# Altium schematic sheet main.SchDoc
size A1
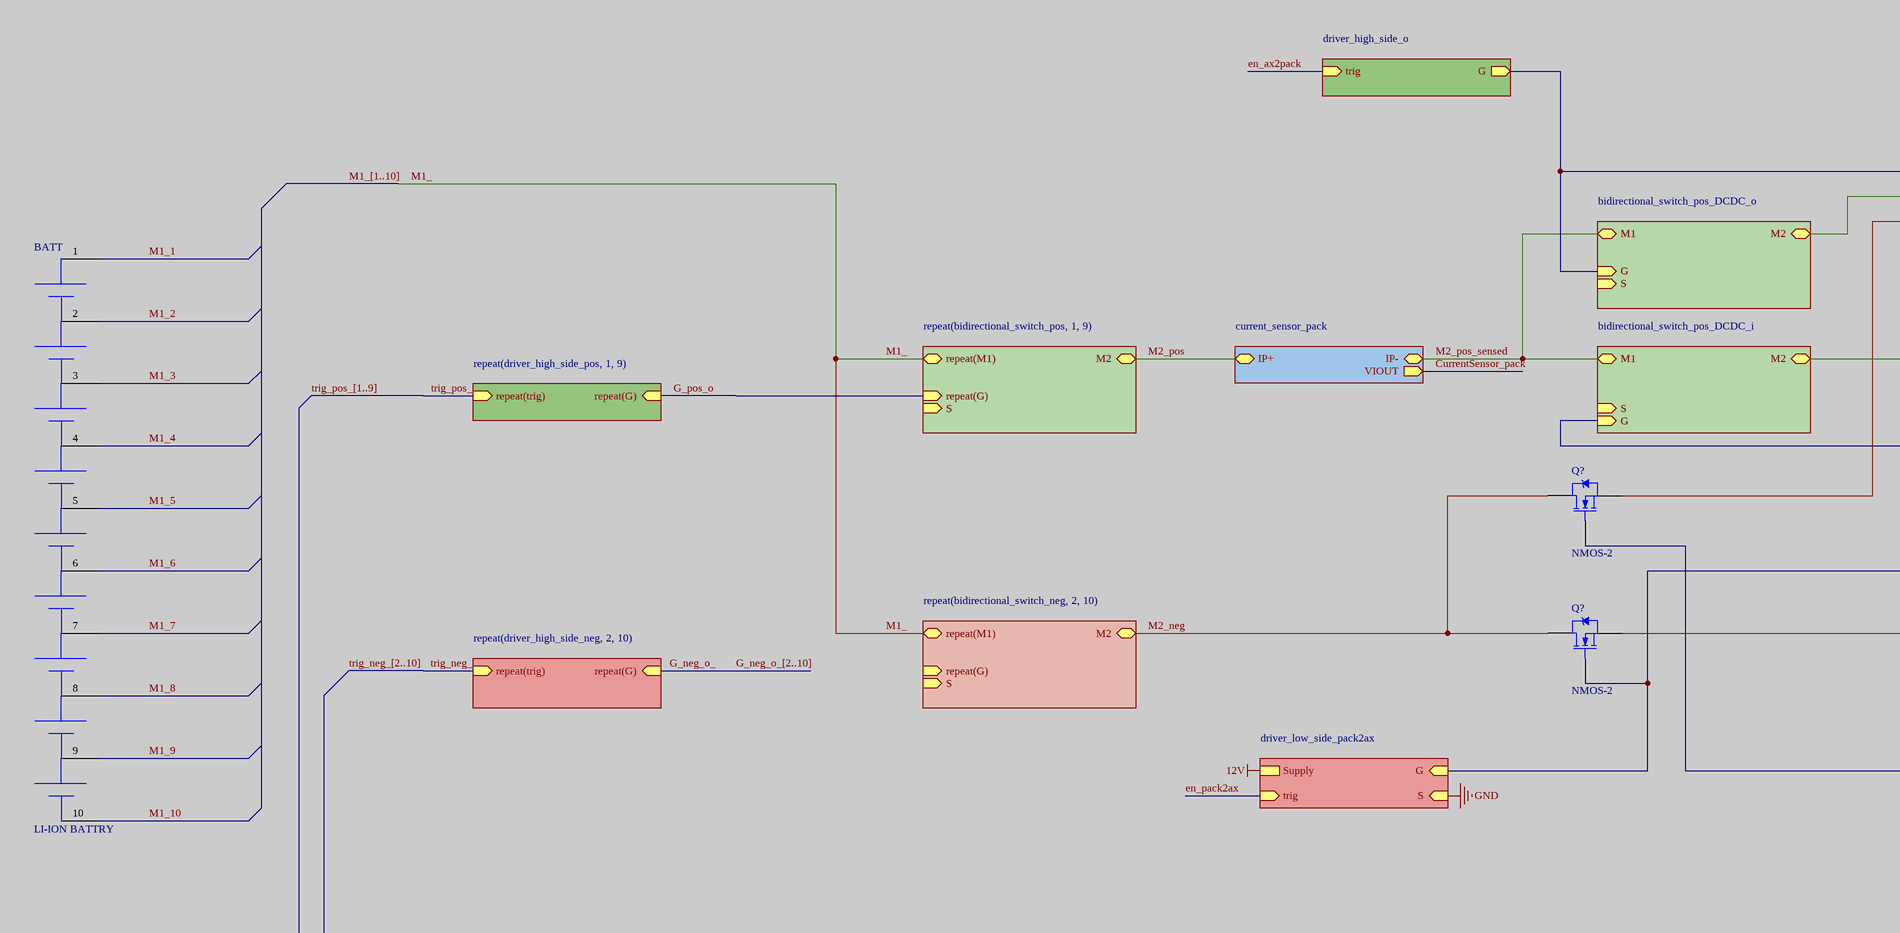
[diagram p0: main.SchDoc, left]
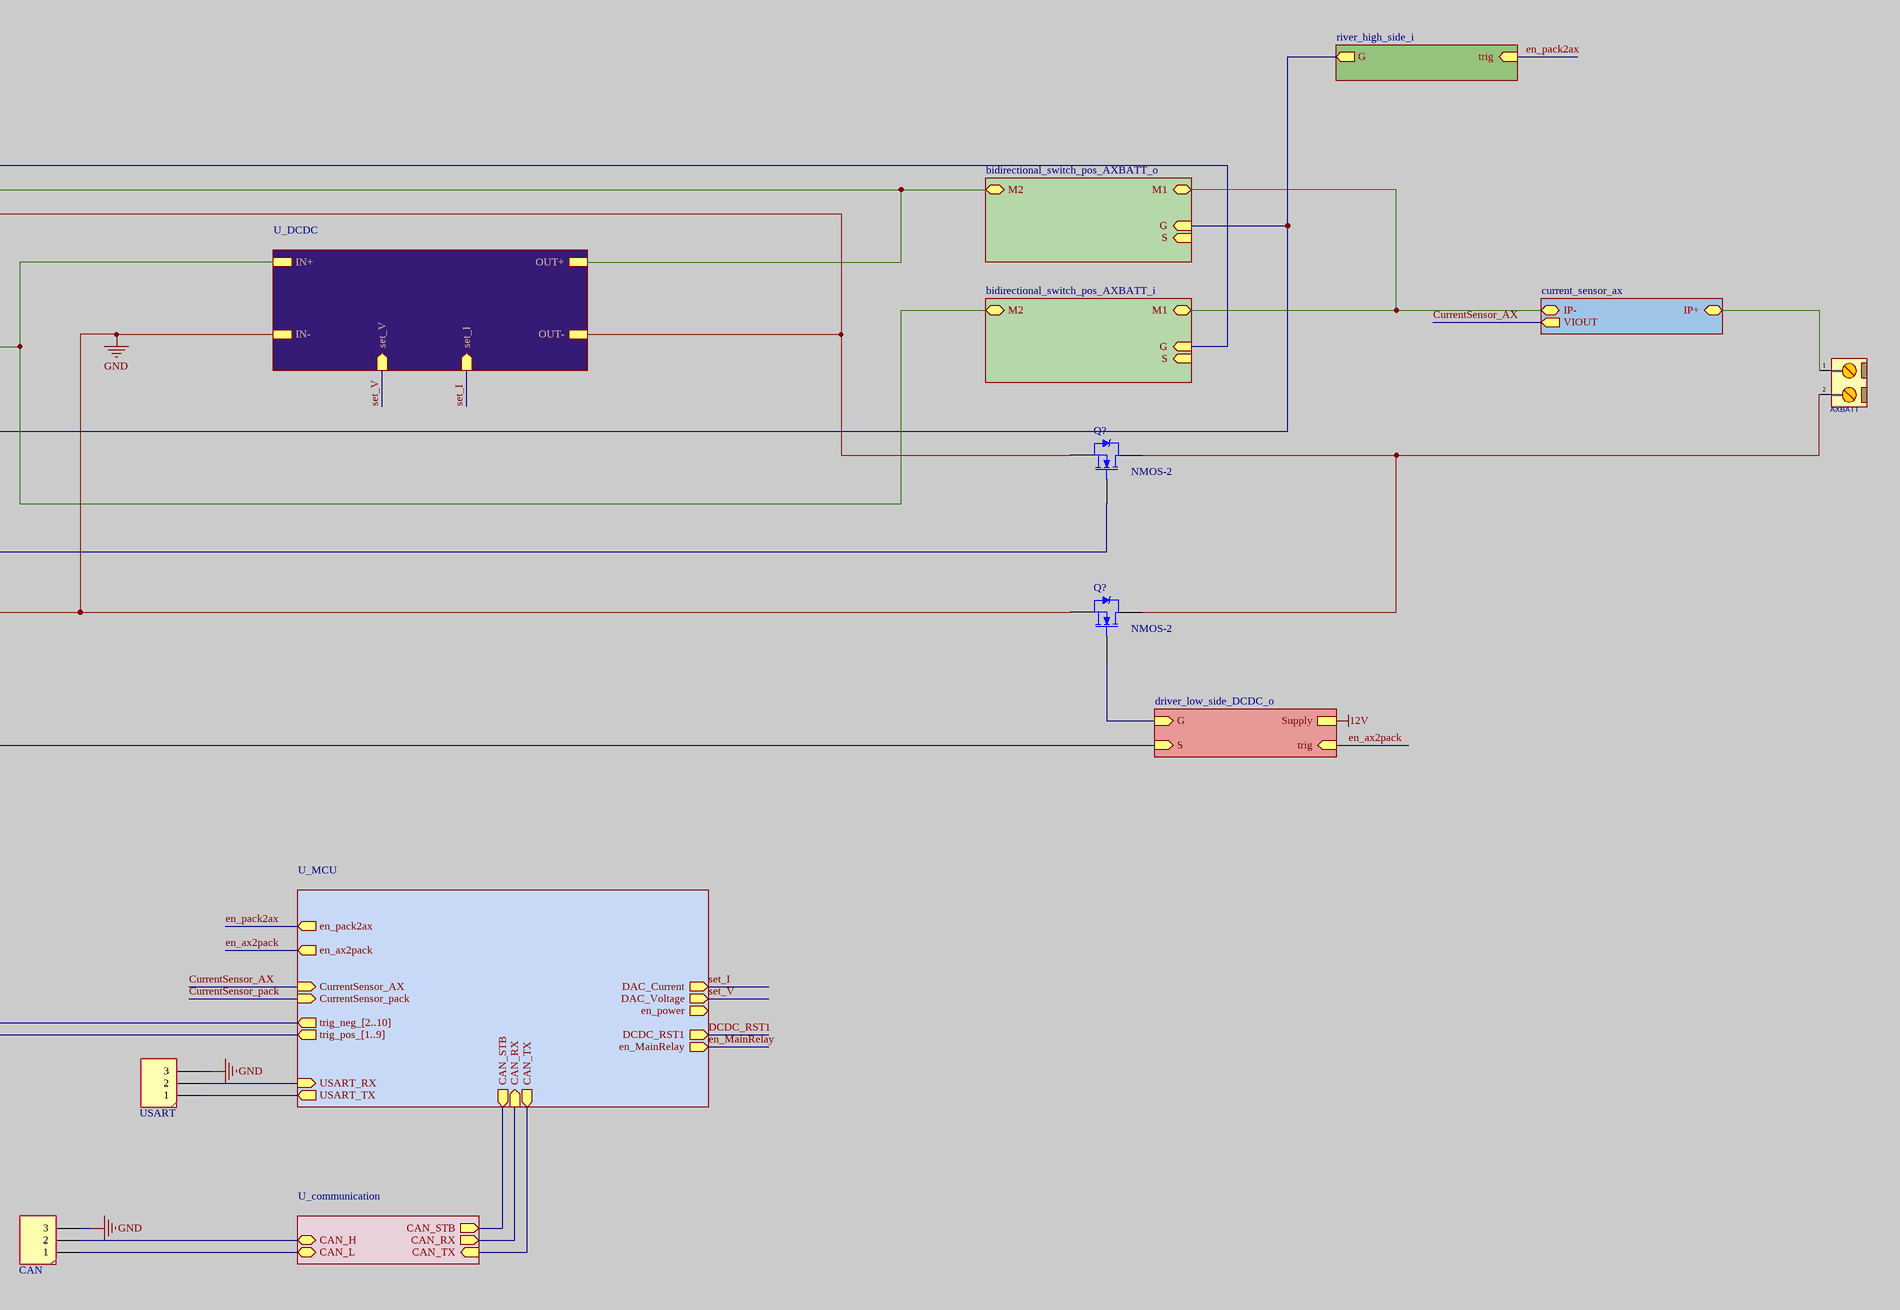
[diagram p1: main.SchDoc, right]

## Parts
(Parts that share a designator on the sheet are numbered #1, #2 ... from top to bottom, then left to right.)
AXBATT  CONN_TB8  (value not drawn)
BATT  LI-ION BATTRY  [HEADER1*10]
CAN  DCDC_CTRL  [HEADER1*3]  (value not drawn)
Q?#1  NMOS-2  [dpak]
Q?#2  NMOS-2  [dpak]
Q?#3  NMOS-2  [dpak]
Q?#4  NMOS-2  [dpak]
USART  DCDC_CTRL  [HEADER1*3]  (value not drawn)

## Sub-sheets
bidirectional_switch_pos_AXBATT_i = bidirectional_switch.SchDoc: M1 (bidir), M2 (bidir), G (in), S (in)
bidirectional_switch_pos_AXBATT_o = bidirectional_switch.SchDoc: M1 (bidir), M2 (bidir), G (in), S (in)
bidirectional_switch_pos_DCDC_i = bidirectional_switch.SchDoc: M1 (bidir), M2 (bidir), G (in), S (in)
bidirectional_switch_pos_DCDC_o = bidirectional_switch.SchDoc: M1 (bidir), M2 (bidir), G (in), S (in)
current_sensor_ax = current_sensor.SchDoc: IP+ (bidir), IP- (bidir), VIOUT (out)
current_sensor_pack = current_sensor.SchDoc: IP+ (bidir), IP- (bidir), VIOUT (out)
driver_high_side_o = driver_high_side.SchDoc: trig (in), G (out)
driver_low_side_DCDC_o = driver_low_side.SchDoc: Supply, trig (in), G (in), S (in)
driver_low_side_pack2ax = driver_low_side.SchDoc: Supply, trig (in), G (in), S (in)
repeat(bidirectional_switch_neg, 2, 10) = bidirectional_switch.SchDoc: repeat(M1) (bidir), M2 (bidir), repeat(G) (in), S (in)
repeat(bidirectional_switch_pos, 1, 9) = bidirectional_switch.SchDoc: repeat(M1) (bidir), M2 (bidir), repeat(G) (in), S (in)
repeat(driver_high_side_neg, 2, 10) = driver_high_side.SchDoc: repeat(trig) (in), repeat(G) (in)
repeat(driver_high_side_pos, 1, 9) = driver_high_side.SchDoc: repeat(trig) (in), repeat(G) (in)
river_high_side_i = driver_high_side.SchDoc: trig (in), G (out)
U_communication = communication.SchDoc: CAN_TX (in), CAN_RX (out), CAN_H (bidir), CAN_L (bidir), CAN_STB (out)
U_DCDC = DCDC.SchDoc: IN+, IN-, OUT+, OUT-, set_V (in), set_I (in)
U_MCU = MCU.SchDoc: CurrentSensor_AX (in), CurrentSensor_pack (in), DAC_Current (out), DAC_Voltage (out), en_power (out), USART_TX (out), USART_RX (in), DCDC_RST1 (out), en_MainRelay (out), CAN_TX (out), CAN_RX (in), CAN_STB (out), trig_pos_[1..9] (out), trig_neg_[2..10] (out), en_pack2ax (out), en_ax2pack (out)

## Nets
12V: sheet driver_low_side_pack2ax/Supply, sheet driver_low_side_DCDC_o/Supply
GND: CAN.3 Q?#3.3(S) Q?#4.3(S) USART.3 ; sheet driver_low_side_pack2ax/S, sheet U_DCDC/IN-
CurrentSensor_AX: sheet current_sensor_ax/VIOUT, sheet U_MCU/CurrentSensor_AX
CurrentSensor_pack: sheet current_sensor_pack/VIOUT, sheet U_MCU/CurrentSensor_pack
DCDC_RST1: sheet U_MCU/DCDC_RST1
en_ax2pack: sheet driver_low_side_DCDC_o/trig, sheet driver_high_side_o/trig, sheet U_MCU/en_ax2pack
en_MainRelay: sheet U_MCU/en_MainRelay
en_pack2ax: sheet driver_low_side_pack2ax/trig, sheet river_high_side_i/trig, sheet U_MCU/en_pack2ax
G_neg_o_: sheet repeat(driver_high_side_neg, 2, 10)/repeat(G)
G_pos_o: sheet repeat(driver_high_side_pos, 1, 9)/repeat(G)
M1_: sheet repeat(bidirectional_switch_neg, 2, 10)/repeat(M1), sheet repeat(bidirectional_switch_pos, 1, 9)/repeat(M1)
M1_1: BATT.1
M1_2: BATT.2
M1_3: BATT.3
M1_4: BATT.4
M1_5: BATT.5
M1_6: BATT.6
M1_7: BATT.7
M1_8: BATT.8
M1_9: BATT.9
M1_10: BATT.10
M2_neg: Q?#2.2(D) Q?#3.2(D) ; sheet repeat(bidirectional_switch_neg, 2, 10)/M2
M2_pos: sheet repeat(bidirectional_switch_pos, 1, 9)/M2, sheet current_sensor_pack/IP+
M2_pos_sensed: sheet bidirectional_switch_pos_DCDC_i/M1, sheet bidirectional_switch_pos_DCDC_o/M1, sheet current_sensor_pack/IP-
set_I: sheet U_MCU/DAC_Current, sheet U_DCDC/set_I
set_V: sheet U_MCU/DAC_Voltage, sheet U_DCDC/set_V
trig_neg_: sheet repeat(driver_high_side_neg, 2, 10)/repeat(trig)
trig_pos_: sheet repeat(driver_high_side_pos, 1, 9)/repeat(trig)
NetAXBATT_1: AXBATT.1 ; sheet current_sensor_ax/IP+
NetAXBATT_2: AXBATT.2 Q?#1.2(D) Q?#4.2(D)
NetCAN_1: CAN.1 ; sheet U_communication/CAN_L
NetCAN_2: CAN.2 ; sheet U_communication/CAN_H
NetQ?#1_1: Q?#1.1(G) Q?#3.1(G) ; sheet driver_low_side_pack2ax/G
NetQ?#1_3: Q?#1.3(S) Q?#2.3(S) ; sheet U_DCDC/OUT-
NetQ?#2_1: Q?#2.1(G) ; sheet driver_low_side_DCDC_o/S
NetQ?#4_1: Q?#4.1(G) ; sheet driver_low_side_DCDC_o/G
NetUSART_1: USART.1 ; sheet U_MCU/USART_TX
NetUSART_2: USART.2 ; sheet U_MCU/USART_RX
(unnamed): sheet bidirectional_switch_pos_DCDC_i/M2, sheet bidirectional_switch_pos_AXBATT_i/M2, sheet U_DCDC/IN+
(unnamed): sheet bidirectional_switch_pos_DCDC_i/G, sheet bidirectional_switch_pos_AXBATT_o/G, sheet river_high_side_i/G
(unnamed): sheet bidirectional_switch_pos_DCDC_o/M2, sheet bidirectional_switch_pos_AXBATT_o/M2, sheet U_DCDC/OUT+
(unnamed): sheet bidirectional_switch_pos_DCDC_o/G, sheet bidirectional_switch_pos_AXBATT_i/G, sheet driver_high_side_o/G
(unnamed): sheet bidirectional_switch_pos_AXBATT_i/M1, sheet bidirectional_switch_pos_AXBATT_o/M1, sheet current_sensor_ax/IP-
(unnamed): sheet U_MCU/CAN_TX, sheet U_communication/CAN_TX
(unnamed): sheet U_MCU/CAN_RX, sheet U_communication/CAN_RX
(unnamed): sheet U_MCU/CAN_STB, sheet U_communication/CAN_STB

## Buses and harness runs
bus G_neg_o_[2..10]
bus M1_[1..10]
bus trig_neg_[2..10] = sheet U_MCU/trig_neg_[2..10]
bus trig_pos_[1..9] = sheet U_MCU/trig_pos_[1..9]

## Library data of the parts
AXBATT = TERMINAL_BLOCK 1 × 2: CONN, TERMINAL BLOCK, 5.08mm pitch; VALUE: CONN_TB8
BATT = BATTRY_pack
CAN USART = Header1*3: Header, 3-Pin; LatestRevisionDate: 17-Jul-2002; LatestRevisionNote: Re-released for DXP Platform.; Publisher: Altium Limited
Q?#1-Q?#4 = NMOS-2: N-Channel Power MOSFET; Note: Pin 2 is electrically connected to pin 4.; Published: 8-Jun-2000; LatestRevisionDate: 17-Jul-2002; LatestRevisionNote: Re-released for DXP Platform.; DatasheetVersion: PD-9.814; PackageVersion: Feb-1997; PackageReference: TO-220AB; Publisher: Altium Limited; PackageDescription: TO, Thru-Hole, Vertical, Heatsink Mounted; 3 In-Line Leads; Pitch 2.54 mm; ComponentLink1Description: Manufacturer Link; ComponentLink1URL: http://www.irf.com/